# EAGLE design QFP80-bo (EAGLE 5.11)
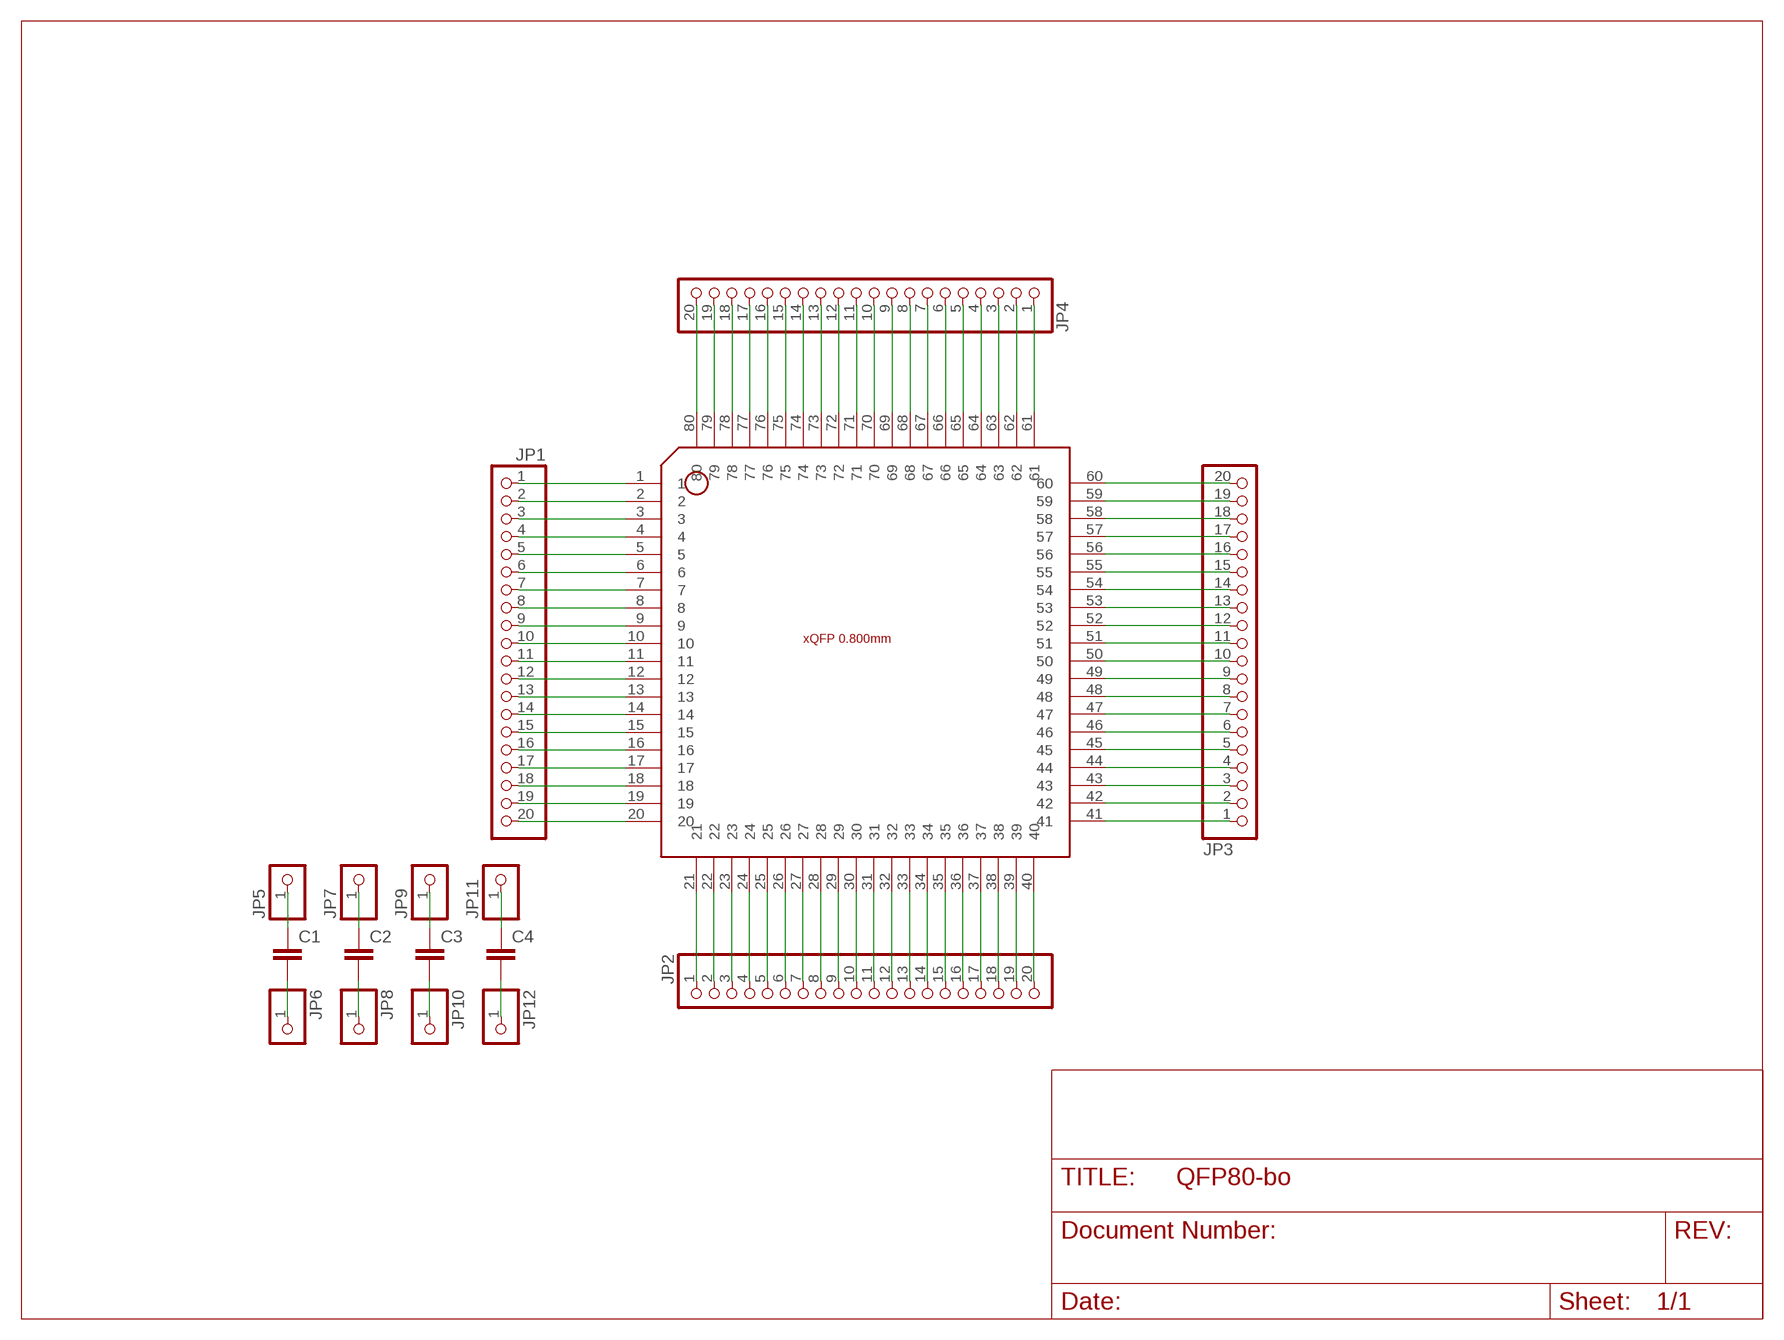
[diagram p0: schematic, sheet 1]

## Parts
C1  CAPC805  [C805]
C2  CAPC805  [C805]
C3  CAPC805  [C805]
C4  CAPC805  [C805]
JP1  PINHD-1X20DUALROW  [2X10]
JP2  PINHD-1X20DUALROW  [2X10]
JP3  PINHD-1X20DUALROW  [2X10]
JP4  PINHD-1X20DUALROW  [2X10]
JP5  PINHD-1X1  [1X01]
JP6  PINHD-1X1  [1X01]
JP7  PINHD-1X1  [1X01]
JP8  PINHD-1X1  [1X01]
JP9  PINHD-1X1  [1X01]
JP10  PINHD-1X1  [1X01]
JP11  PINHD-1X1  [1X01]
JP12  PINHD-1X1  [1X01]
U$1  BB_XQFP_080  [BB_QFP_080]

## Nets
N$1: JP1.1 U$1.1
N$2: JP1.2 U$1.2
N$3: JP1.3 U$1.3
N$4: JP1.4 U$1.4
N$5: JP1.5 U$1.5
N$6: JP1.6 U$1.6
N$7: JP1.7 U$1.7
N$8: JP1.8 U$1.8
N$9: JP1.9 U$1.9
N$10: JP1.10 U$1.10
N$11: JP1.11 U$1.11
N$12: JP1.12 U$1.12
N$13: JP1.13 U$1.13
N$14: JP1.14 U$1.14
N$15: JP1.15 U$1.15
N$16: JP1.16 U$1.16
N$17: JP1.17 U$1.17
N$18: JP1.18 U$1.18
N$19: JP1.19 U$1.19
N$20: JP1.20 U$1.20
N$21: JP2.1 U$1.21
N$22: JP2.2 U$1.22
N$23: JP2.3 U$1.23
N$24: JP2.4 U$1.24
N$25: JP2.5 U$1.25
N$26: JP2.6 U$1.26
N$27: JP2.7 U$1.27
N$28: JP2.8 U$1.28
N$29: JP2.9 U$1.29
N$30: JP2.10 U$1.30
N$31: JP2.11 U$1.31
N$32: JP2.12 U$1.32
N$33: JP2.13 U$1.33
N$34: JP2.14 U$1.34
N$35: JP2.15 U$1.35
N$36: JP2.16 U$1.36
N$37: JP2.17 U$1.37
N$38: JP2.18 U$1.38
N$39: JP2.19 U$1.39
N$40: JP2.20 U$1.40
N$41: JP3.1 U$1.41
N$42: JP3.2 U$1.42
N$43: JP3.3 U$1.43
N$44: JP3.4 U$1.44
N$45: JP3.5 U$1.45
N$46: JP3.6 U$1.46
N$47: JP3.7 U$1.47
N$48: JP3.8 U$1.48
N$49: JP3.9 U$1.49
N$50: JP3.10 U$1.50
N$51: JP3.11 U$1.51
N$52: JP3.12 U$1.52
N$53: JP3.13 U$1.53
N$54: JP3.14 U$1.54
N$55: JP3.15 U$1.55
N$56: JP3.16 U$1.56
N$57: JP3.17 U$1.57
N$58: JP3.18 U$1.58
N$59: JP3.19 U$1.59
N$60: JP3.20 U$1.60
N$61: JP4.1 U$1.61
N$62: JP4.2 U$1.62
N$63: JP4.3 U$1.63
N$64: JP4.4 U$1.64
N$65: JP4.5 U$1.65
N$66: JP4.6 U$1.66
N$67: JP4.7 U$1.67
N$68: JP4.8 U$1.68
N$69: JP4.9 U$1.69
N$70: JP4.10 U$1.70
N$71: JP4.11 U$1.71
N$72: JP4.12 U$1.72
N$73: JP4.13 U$1.73
N$74: JP4.14 U$1.74
N$75: JP4.15 U$1.75
N$76: JP4.16 U$1.76
N$77: JP4.17 U$1.77
N$78: JP4.18 U$1.78
N$79: JP4.19 U$1.79
N$80: JP4.20 U$1.80
N$81: C1.1 JP5.1
N$82: C1.2 JP6.1
N$83: C2.1 JP7.1
N$84: C2.2 JP8.1
N$85: C3.1 JP9.1
N$86: C3.2 JP10.1
N$87: C4.1 JP11.1
N$88: C4.2 JP12.1

## Library data of the parts
C1-C4 = dp_devices:CAP
JP1-JP4 = pinhead:PINHD-1X20: PIN HEADER
JP5-JP12 = pinhead:PINHD-1X1: PIN HEADER
U$1 = DP_protoboard:BB_XQFP_080

## Board
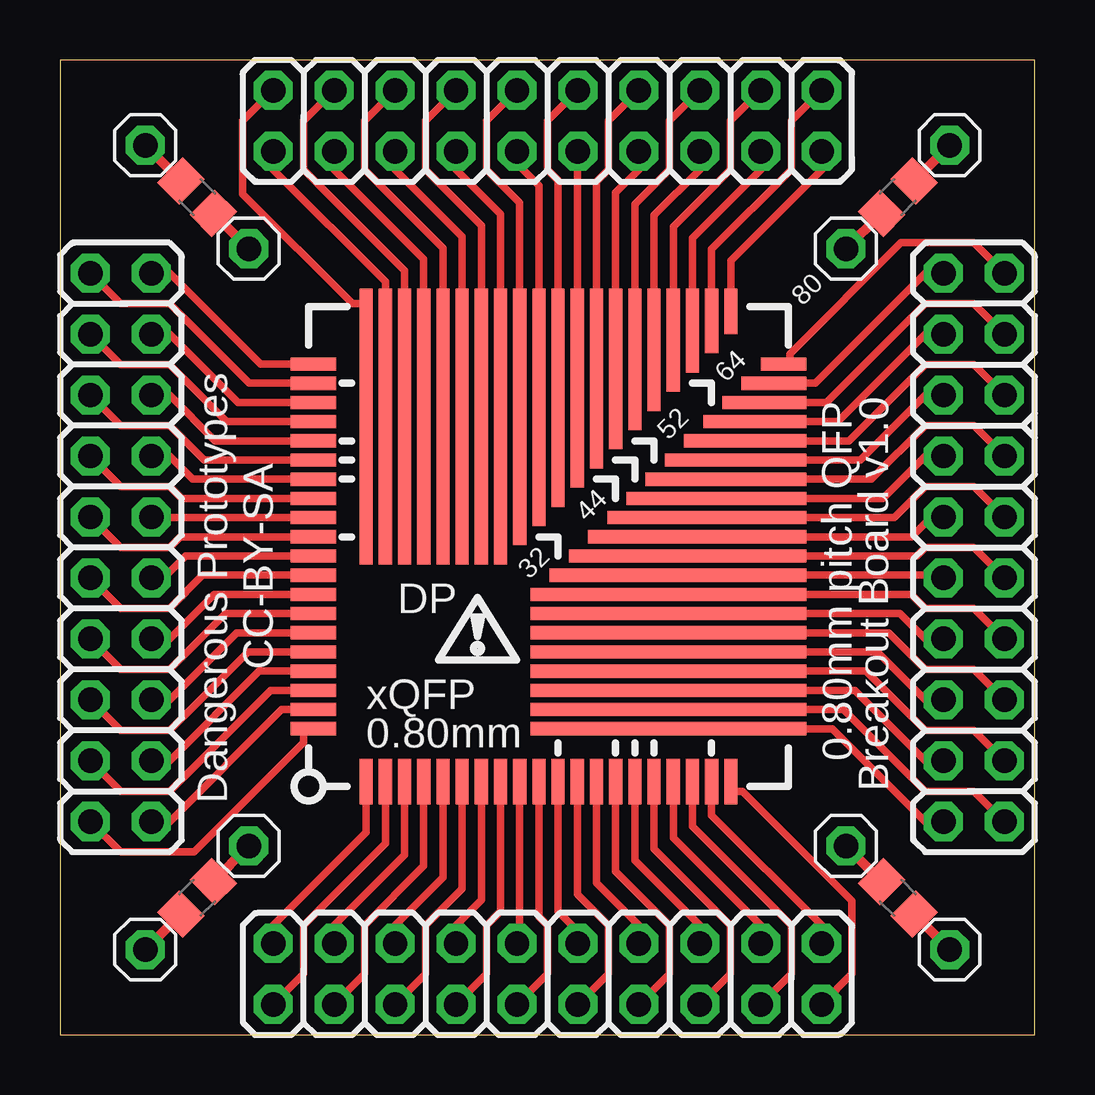
[diagram p1: board, top side]
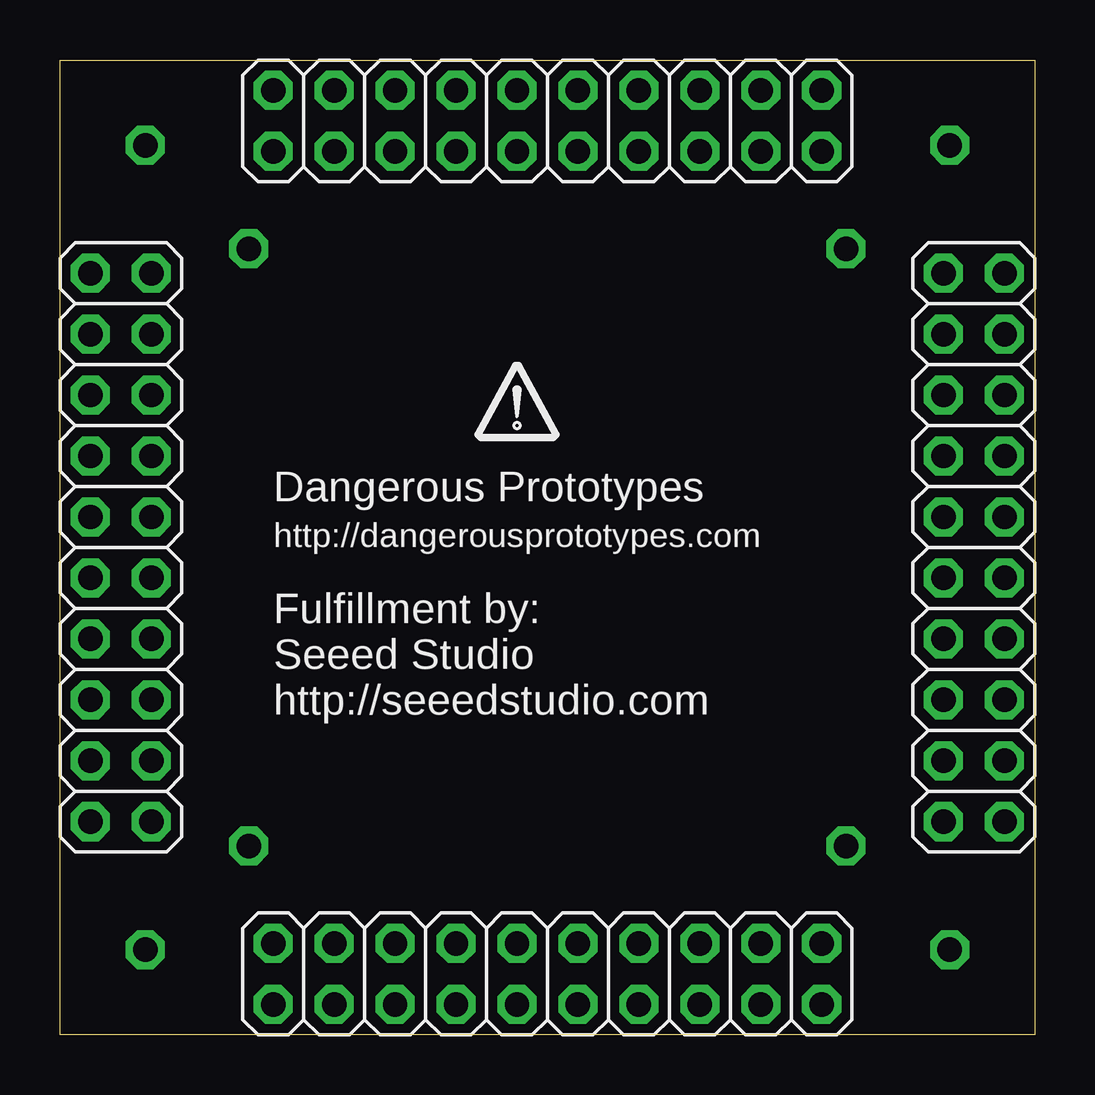
[diagram p2: board, bottom side, seen from below]

Size 40.64 x 40.64 mm. Coordinates in mm from the lower left corner, seen from the top.
Outline: 0,0 40.64,0 40.64,40.64 0,40.64 0,0
Copper layers (1*16): Top 0.035mm / dielectric 1.5mm / Bottom 0.035mm
Design rules "SparkFun *": minimum track width 8mil, minimum drill 20mil, track to track 8mil, track to pad 6mil, pad to pad 6mil, via to via 8mil, smd to smd 6mil, copper to edge 10mil, drill to drill 8mil, minimum pad ring 12mil, minimum via ring 10mil, stop-mask expansion 4mil, vias tented up to drill 25mil, thermal gap 10mil

### Footprints (pad centres in the part's own frame; a part is rotated, then mirrored left to right if it is on the bottom)
C805 = smd 1.3 x 1.5: 1 -0.95,0; 2 0.95,0
2X10 = drill 1.016 octagon: 1 -11.43,-1.27; 2 -11.43,1.27; 3 -8.89,-1.27; 4 -8.89,1.27; 5 -6.35,-1.27; 6 -6.35,1.27; 7 -3.81,-1.27; 8 -3.81,1.27; 9 -1.27,-1.27; 10 -1.27,1.27; 11 1.27,-1.27; 12 1.27,1.27; 13 3.81,-1.27; 14 3.81,1.27; 15 6.35,-1.27; 16 6.35,1.27; 17 8.89,-1.27; 18 8.89,1.27; 19 11.43,-1.27; 20 11.43,1.27
1X01 = drill 1.016 octagon: 1 0,0
BB_QFP_080 = smd 0.55 x 1.9: 1 -4,-6.2; 2 -3.2,-6.2; 3 -2.4,-6.2; 4 -1.6,-6.2; 5 -0.8,-6.2; 6 0,-6.2; 7 0.8,-6.2; 8 1.6,-6.2; 9 2.4,-6.2; 10 3.2,-6.2; 11 4,-6.2; 12 4.8,-6.2; 13 5.6,-6.2; 14 6.4,-6.2; 15 7.2,-6.2; 16 8,-6.2; 17 8.8,-6.2; 18 9.6,-6.2; 19 10.4,-6.2; 20 11.2,-6.2; 41 11.2,13.4 | smd 11.5 x 0.55: 21 8.6,-4; 22 8.6,-3.2; 23 8.6,-2.4; 24 8.6,-1.6; 25 8.6,-0.8; 26 8.6,0; 27 8.6,0.8; 28 8.6,1.6 | smd 10.7 x 0.55: 29 9,2.4 | smd 9.9 x 0.55: 30 9.4,3.2 | smd 9.1 x 0.55: 31 9.8,4 | smd 8.3 x 0.55: 32 10.2,4.8 | smd 7.5 x 0.55: 33 10.6,5.6 | smd 6.7 x 0.55: 34 11,6.4 | smd 5.9 x 0.55: 35 11.4,7.2 | smd 5.1 x 0.55: 36 11.8,8 | smd 4.3 x 0.55: 37 12.2,8.8 | smd 3.5 x 0.55: 38 12.6,9.6 | smd 2.7 x 0.55: 39 13,10.4 | smd 1.9 x 0.55: 40 13.4,11.2; 61 -6.2,11.2; 62 -6.2,10.4; 63 -6.2,9.6; 64 -6.2,8.8; 65 -6.2,8; 66 -6.2,7.2; 67 -6.2,6.4; 68 -6.2,5.6; 69 -6.2,4.8; 70 -6.2,4; 71 -6.2,3.2; 72 -6.2,2.4; 73 -6.2,1.6; 74 -6.2,0.8; 75 -6.2,0; 76 -6.2,-0.8; 77 -6.2,-1.6; 78 -6.2,-2.4; 79 -6.2,-3.2; 80 -6.2,-4 | smd 0.55 x 2.7: 42 10.4,13 | smd 0.55 x 3.5: 43 9.6,12.6 | smd 0.55 x 4.3: 44 8.8,12.2 | smd 0.55 x 5.1: 45 8,11.8 | smd 0.55 x 5.9: 46 7.2,11.4 | smd 0.55 x 6.7: 47 6.4,11 | smd 0.55 x 7.5: 48 5.6,10.6 | smd 0.55 x 8.3: 49 4.8,10.2 | smd 0.55 x 9.1: 50 4,9.8 | smd 0.55 x 9.9: 51 3.2,9.4 | smd 0.55 x 10.7: 52 2.4,9 | smd 0.55 x 11.5: 53 1.6,8.6; 54 0.8,8.6; 55 0,8.6; 56 -0.8,8.6; 57 -1.6,8.6; 58 -2.4,8.6; 59 -3.2,8.6; 60 -4,8.6

### Placement (x,y rotation side)
C1  5.71,5.71 45 top
C2  5.71,34.92 135 top
C3  34.92,5.71 315 top
C4  34.92,34.92 45 top
JP1  20.32,2.54 180 bottom
JP2  38.1,20.32 90 bottom
JP3  20.32,38.1 0 bottom
JP4  2.54,20.32 270 bottom
JP5  3.56,3.56 0 top
JP6  7.87,7.87 0 top
JP7  7.87,32.77 0 top
JP8  3.56,37.08 0 top
JP9  32.77,7.87 0 top
JP10  37.08,3.56 0 top
JP11  32.77,32.77 0 top
JP12  37.08,37.08 0 top
U$1  16.76,16.76 0 top
U$2  [DP_LOGO]  21.59,25.4 0 bottom

### Tracks (layer width: path | path; a pad name or v marks a point on that pad's centre or on a via)
N$1
  Top 0.305: U$1.1 12.76,8.45 8.89,4.57 JP1.1
N$2
  Top 0.305: U$1.2 13.56,7.98 10.16,4.57 10.16,2.54 JP1.2
N$3
  Top 0.305: U$1.3 14.36,7.51 11.43,4.57 JP1.3
N$4
  Top 0.305: U$1.4 15.16,7.04 12.7,4.57 12.7,2.54 JP1.4
N$5
  Top 0.305: U$1.5 15.96,6.57 13.97,4.57 JP1.5
N$6
  Top 0.305: U$1.6 16.76,6.1 15.24,4.57 15.24,2.54 JP1.6
N$7
  Top 0.305: U$1.7 17.56,5.63 16.51,4.57 JP1.7
N$8
  Top 0.305: U$1.8 18.36,5.16 17.78,4.57 17.78,2.54 JP1.8
N$9
  Top 0.305: U$1.9 19.16,3.92 JP1.9
N$10
  Top 0.305: U$1.10 19.96,4.93 20.32,4.57 20.32,2.54 JP1.10
N$11
  Top 0.305: U$1.11 20.76,5.14 21.59,4.32 JP1.11
N$12
  Top 0.305: U$1.12 21.56,5.87 22.86,4.57 22.86,2.54 JP1.12
N$13
  Top 0.305: U$1.13 22.36,6.34 24.13,4.57 JP1.13
N$14
  Top 0.305: U$1.14 23.16,6.81 25.4,4.57 25.4,2.54 JP1.14
N$15
  Top 0.305: U$1.15 23.96,7.28 26.67,4.57 JP1.15
N$16
  Top 0.305: U$1.16 24.76,7.75 27.94,4.57 27.94,2.54 JP1.16
N$17
  Top 0.305: U$1.17 25.56,8.22 29.21,4.57 JP1.17
N$18
  Top 0.305: U$1.18 26.36,8.69 30.48,4.57 30.48,2.54 JP1.18
N$19
  Top 0.305: U$1.19 27.16,9.16 31.75,4.57 JP1.19
N$20
  Top 0.305: JP1.20 33.02,2.54 33.02,5.59 28.45,10.16 27.96,10.16 U$1.20
N$21
  Top 0.305: U$1.21 32.19,12.76 36.07,8.89 JP2.1
N$22
  Top 0.305: U$1.22 32.66,13.56 36.07,10.16 38.1,10.16 JP2.2
N$23
  Top 0.305: U$1.23 33.13,14.36 36.07,11.43 JP2.3
N$24
  Top 0.305: U$1.24 33.6,15.16 36.07,12.7 38.1,12.7 JP2.4
N$25
  Top 0.305: U$1.25 34.07,15.96 36.07,13.97 JP2.5
N$26
  Top 0.305: U$1.26 34.54,16.76 36.07,15.24 38.1,15.24 JP2.6
N$27
  Top 0.305: U$1.27 35.01,17.56 36.07,16.51 JP2.7
N$28
  Top 0.305: U$1.28 35.48,18.36 36.07,17.78 38.1,17.78 JP2.8
N$29
  Top 0.305: U$1.29 36.72,19.16 JP2.9
N$30
  Top 0.305: U$1.30 35.71,19.96 36.07,20.32 38.1,20.32 JP2.10
N$31
  Top 0.305: U$1.31 35.5,20.76 36.32,21.59 JP2.11
N$32
  Top 0.305: U$1.32 34.77,21.56 36.07,22.86 38.1,22.86 JP2.12
N$33
  Top 0.305: U$1.33 34.3,22.36 36.07,24.13 JP2.13
N$34
  Top 0.305: U$1.34 33.83,23.16 36.07,25.4 38.1,25.4 JP2.14
N$35
  Top 0.305: U$1.35 33.36,23.96 36.07,26.67 JP2.15
N$36
  Top 0.305: U$1.36 32.89,24.76 36.07,27.94 38.1,27.94 JP2.16
N$37
  Top 0.305: U$1.37 32.42,25.56 36.07,29.21 JP2.17
N$38
  Top 0.305: U$1.38 31.95,26.36 36.07,30.48 38.1,30.48 JP2.18
N$39
  Top 0.305: U$1.39 31.48,27.16 36.07,31.75 JP2.19
N$40
  Top 0.305: JP2.20 38.1,33.02 35.05,33.02 30.42,28.39 30.42,27.96 U$1.40
N$41
  Top 0.305: U$1.41 27.96,32.28 31.75,36.07 JP3.1
N$42
  Top 0.305: U$1.42 27.16,32.75 30.48,36.07 30.48,38.1 JP3.2
N$43
  Top 0.305: U$1.43 26.36,33.22 29.21,36.07 JP3.3
N$44
  Top 0.305: U$1.44 25.56,33.69 27.94,36.07 27.94,38.1 JP3.4
N$45
  Top 0.305: U$1.45 24.76,34.16 26.67,36.07 JP3.5
N$46
  Top 0.305: U$1.46 23.96,34.63 25.4,36.07 25.4,38.1 JP3.6
N$47
  Top 0.305: U$1.47 23.16,35.1 24.13,36.07 JP3.7
N$48
  Top 0.305: U$1.48 22.36,35.57 22.86,36.07 22.86,38.1 JP3.8
N$49
  Top 0.305: U$1.49 21.56,36.8 JP3.9
N$50
  Top 0.305: U$1.50 20.76,35.62 20.32,36.07 20.32,38.1 JP3.10
N$51
  Top 0.305: U$1.51 19.96,35.41 19.05,36.32 JP3.11
N$52
  Top 0.305: U$1.52 19.16,34.68 17.78,36.07 17.78,38.1 JP3.12
N$53
  Top 0.305: U$1.53 18.36,34.21 16.51,36.07 JP3.13
N$54
  Top 0.305: U$1.54 17.56,33.74 15.24,36.07 15.24,38.1 JP3.14
N$55
  Top 0.305: U$1.55 16.76,33.27 13.97,36.07 JP3.15
N$56
  Top 0.305: U$1.56 15.96,32.8 12.7,36.07 12.7,38.1 JP3.16
N$57
  Top 0.305: U$1.57 15.16,32.33 11.43,36.07 JP3.17
N$58
  Top 0.305: U$1.58 14.36,31.86 10.16,36.07 10.16,38.1 JP3.18
N$59
  Top 0.305: U$1.59 13.56,31.39 8.89,36.07 JP3.19
N$60
  Top 0.305: U$1.60 12.76,30.16 | 12.76,30.16 12.7,30.23 | JP3.20 7.62,38.1 7.62,35.05 12.19,30.48 12.76,30.48 12.76,30.16
N$61
  Top 0.305: U$1.61 8.36,27.96 4.57,31.75 JP4.1
N$62
  Top 0.305: U$1.62 7.89,27.16 4.57,30.48 2.54,30.48 JP4.2
N$63
  Top 0.305: U$1.63 7.42,26.36 4.57,29.21 JP4.3
N$64
  Top 0.305: U$1.64 6.95,25.56 4.57,27.94 2.54,27.94 JP4.4
N$65
  Top 0.305: U$1.65 6.48,24.76 4.57,26.67 JP4.5
N$66
  Top 0.305: U$1.66 6.01,23.96 4.57,25.4 2.54,25.4 JP4.6
N$67
  Top 0.305: U$1.67 5.54,23.16 4.57,24.13 JP4.7
N$68
  Top 0.305: U$1.68 5.07,22.36 4.57,22.86 2.54,22.86 JP4.8
N$69
  Top 0.305: U$1.69 3.84,21.56 JP4.9
N$70
  Top 0.305: U$1.70 5.02,20.76 4.57,20.32 2.54,20.32 JP4.10
N$71
  Top 0.305: U$1.71 5.23,19.96 4.32,19.05 JP4.11
N$72
  Top 0.305: U$1.72 5.96,19.16 4.57,17.78 2.54,17.78 JP4.12
N$73
  Top 0.305: U$1.73 6.43,18.36 4.57,16.51 JP4.13
N$74
  Top 0.305: U$1.74 6.9,17.56 4.57,15.24 2.54,15.24 JP4.14
N$75
  Top 0.305: U$1.75 7.37,16.76 4.57,13.97 JP4.15
N$76
  Top 0.305: U$1.76 7.84,15.96 4.57,12.7 2.54,12.7 JP4.16
N$77
  Top 0.305: U$1.77 8.31,15.16 4.57,11.43 JP4.17
N$78
  Top 0.305: U$1.78 8.78,14.36 4.57,10.16 2.54,10.16 JP4.18
N$79
  Top 0.305: U$1.79 9.25,13.56 4.57,8.89 JP4.19
N$80
  Top 0.305: JP4.20 2.54,7.62 5.59,7.62 10.16,12.19 10.16,12.76 U$1.80
N$81
  Top 0.406: JP5.1 C1.1
N$82
  Top 0.406: C1.2 JP6.1
N$83
  Top 0.406: C2.1 | JP7.1 C2.1
N$84
  Top 0.406: JP8.1 | JP8.1 C2.2
N$85
  Top 0.406: C3.1 | JP9.1 C3.1
N$86
  Top 0.406: C3.2 | JP10.1 C3.2
N$87
  Top 0.406: JP11.1 C4.1
N$88
  Top 0.406: JP12.1 C4.2

### Text on the board
tNames: CC-BY-SA | 0.80mm pitch QFP | Dangerous Prototypes | Breakout Board v1.0
bNames: Dangerous Prototypes | http://dangerousprototypes.com | Fulfillment by: | Seeed Studio | http://seeedstudio.com